# EAGLE design 2lboard (EAGLE 7.2.0)
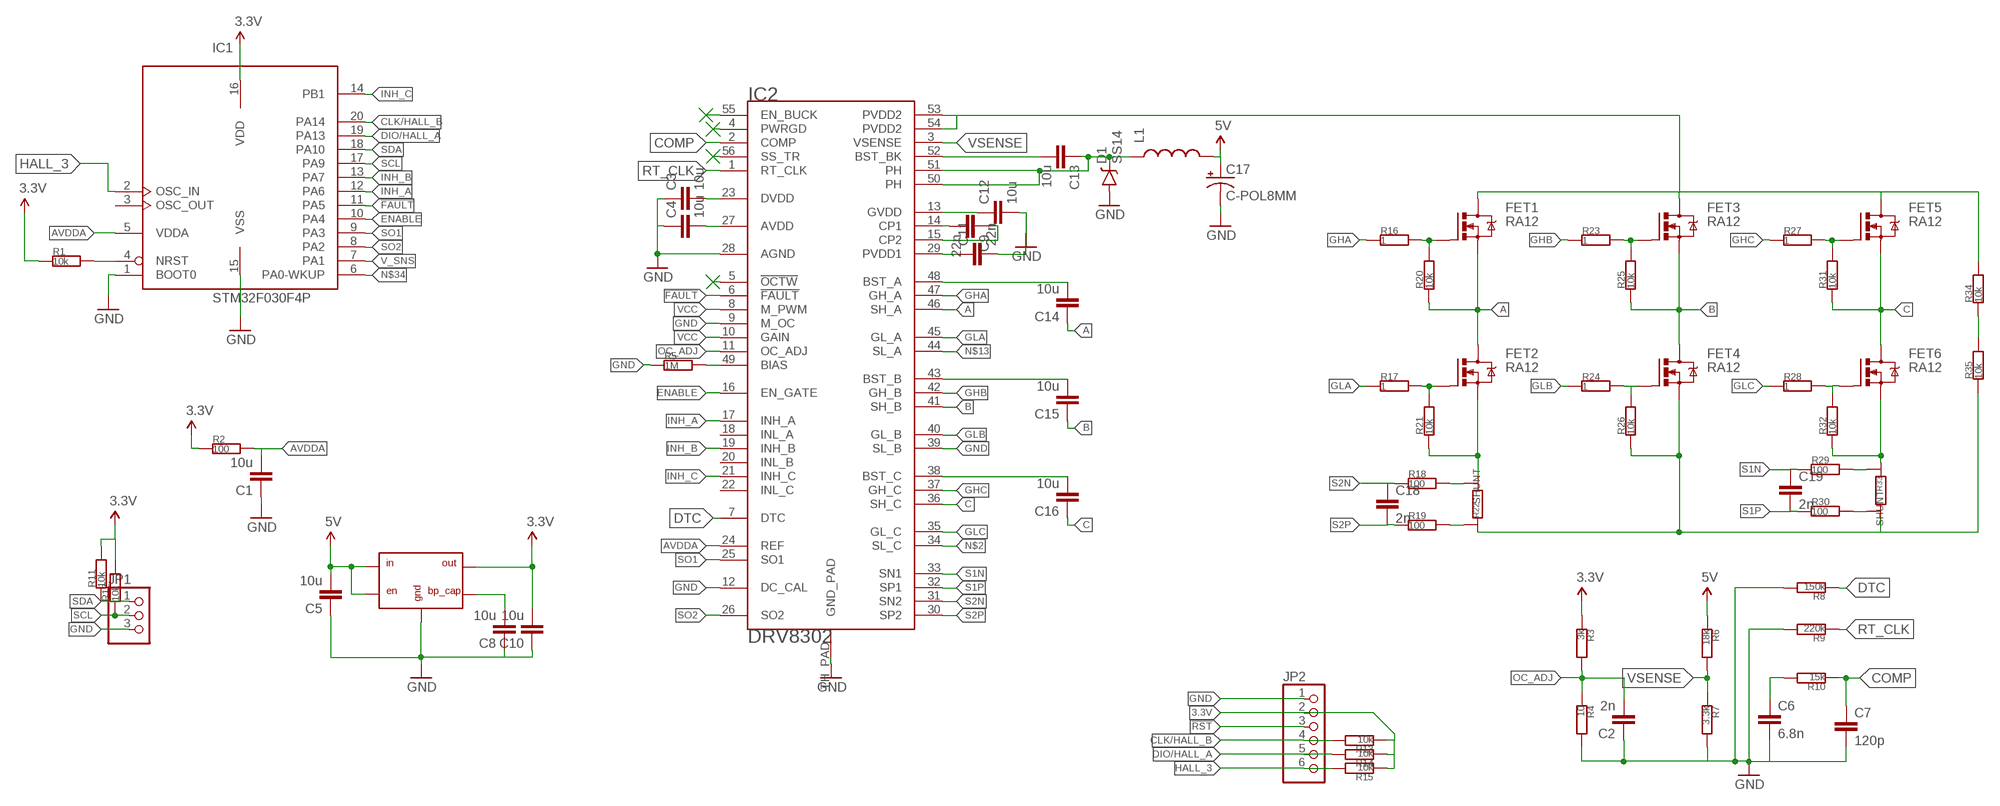
[diagram p0: schematic, sheet 1]

## Parts
C1  10u  CC0805  [C0805]
C2  2n  CC0805  [C0805]
C3  10u  CC0805  [C0805]
C4  10u  CC0805  [C0805]
C5  10u  CC0805  [C0805]
C6  6.8n  CC0805  [C0805]
C7  120p  CC0805  [C0805]
C8  10u  CC0805  [C0805]
C9  22n  CC0805  [C0805]
C10  10u  CC0805  [C0805]
C11  22n  CC0805  [C0805]
C12  10u  CC0805  [C0805]
C13  10u  CC0805  [C0805]
C14  10u  CC0805  [C0805]
C15  10u  CC0805  [C0805]
C16  10u  CC0805  [C0805]
C17  C-POL8MM  [PCAP8]
C18  2n  CC0805  [C0805]
C19  2n  CC0805  [C0805]
D1  SS14  [SMA-DIODE]
FET1  RA12  [POWERPAK_SO8]
FET2  RA12  [POWERPAK_SO8]
FET3  RA12  [POWERPAK_SO8]
FET4  RA12  [POWERPAK_SO8]
FET5  RA12  [POWERPAK_SO8]
FET6  RA12  [POWERPAK_SO8]
IC1  STM32F030F4P  [TSSOP20-I]
IC2  DRV8302  [HTSSOP56DCA]
IC3  LM258DG  [SOT23-5L]
JP1  PINHD-1X03_2.54  [1X03]
JP2  PINHD-1X06_2.54  [1X06]
L1  INDUCTORSRU1038  [SRU1038]
R1  10k  R0603  [0603]
R2  100  R0603  [0603]
R3  3k  R0603  [0603]
R4  10  R0603  [0603]
R5  1M  R0603  [0603]
R6  18k  R0603  [0603]
R7  3.3k  R0603  [0603]
R8  150k  R0603  [0603]
R9  220k  R0603  [0603]
R10  15k  R0603  [0603]
R11  10k  R0603  [0603]
R12  10k  R0603  [0603]
R13  10k  R0603  [0603]
R14  10k  R0603  [0603]
R15  10k  R0603  [0603]
R16  1  R0603  [0603]
R17  1  R0603  [0603]
R18  100  R0603  [0603]
R19  100  R0603  [0603]
R20  10k  R0603  [0603]
R21  10k  R0603  [0603]
R22  SHUNT  [SHUNT]
R23  1  R0603  [0603]
R24  1  R0603  [0603]
R25  10k  R0603  [0603]
R26  10k  R0603  [0603]
R27  1  R0603  [0603]
R28  1  R0603  [0603]
R29  100  R0603  [0603]
R30  100  R0603  [0603]
R31  10k  R0603  [0603]
R32  10k  R0603  [0603]
R33  SHUNT  [SHUNT]
R34  10k  R0603  [0603]
R35  10k  R0603  [0603]

## Nets
3.3V: C10.2 IC1.16(VDD) IC3.5(OUT) JP2.2 R1.1 R2.1 R3.1 R11.2 R12.2 R13.1 R14.1 R15.1
5V: C5.2 C17.P$1(+) IC3.1(IN) IC3.3(EN) L1.2 R6.1
!FAULT: IC1.11(PA5) IC2.6(!FAULT)
!RST: IC1.4(NRST) JP2.3 R1.2
A: C14.1 FET1.1(S) FET1.2(S) FET1.3(S) FET2.5(D) FET2.6(D) FET2.7(D) FET2.8(D) FET2.P$1(D) IC2.46(SH_A) R20.1
AVDDA: C1.2 IC1.5(VDDA) IC2.24(REF) R2.2
B: C15.1 FET3.1(S) FET3.2(S) FET3.3(S) FET4.5(D) FET4.6(D) FET4.7(D) FET4.8(D) FET4.P$1(D) IC2.41(SH_B) R25.1
C: C16.1 FET5.1(S) FET5.2(S) FET5.3(S) FET6.5(D) FET6.6(D) FET6.7(D) FET6.8(D) FET6.P$1(D) IC2.36(SH_C) R31.1
CLK/HALL_B: IC1.20(PA14) JP2.4 R13.2
COMP: C7.1 IC2.2(COMP) R10.1
DIO/HALL_A: IC1.19(PA13) JP2.5 R14.2
DTC: IC2.7(DTC) R8.1
ENABLE: IC1.10(PA4) IC2.16(EN_GATE)
GHA: IC2.47(GH_A) R16.1
GHB: IC2.42(GH_B) R23.1
GHC: IC2.37(GH_C) R27.1
GLA: IC2.45(GL_A) R17.1
GLB: IC2.40(GL_B) R24.1
GLC: IC2.35(GL_C) R28.1
GND: C1.1 C2.1 C3.1 C4.1 C5.1 C6.2 C7.2 C8.1 C10.1 C11.2 C12.2 C17.P$2(-) D1.A FET4.1(S) FET4.2(S) FET4.3(S) IC1.1(BOOT0) IC1.15(VSS) IC2.9(M_OC) IC2.12(DC_CAL) IC2.28(AGND) IC2.39(SL_B) IC2.TH_PAD(GND_PAD) IC3.2(GND) JP1.3 JP2.1 R4.2 R5.1 R7.2 R8.2 R9.2 R22.P$1 R26.1 R33.P$2 R35.1
HALL_3: IC1.2(OSC_IN) JP2.6 R15.2
INH_A: IC1.12(PA6) IC2.17(INH_A)
INH_B: IC1.13(PA7) IC2.19(INH_B)
INH_C: IC1.14(PB1) IC2.21(INH_C)
N$2: FET6.1(S) FET6.2(S) FET6.3(S) IC2.34(SL_C) R32.1 R33.P$1
N$3: C14.2 IC2.48(BST_A)
N$4: C15.2 IC2.43(BST_B)
N$5: FET5.4(G) R27.2 R31.2
N$6: FET3.4(G) R23.2 R25.2
N$7: FET1.4(G) R16.2 R20.2
N$8: FET2.4(G) R17.2 R21.2
N$9: FET4.4(G) R24.2 R26.2
N$10: C16.2 IC2.38(BST_C)
N$11: FET6.4(G) R28.2 R32.2
N$12: IC2.49(BIAS) R5.2
N$13: FET2.1(S) FET2.2(S) FET2.3(S) IC2.44(SL_A) R21.1 R22.P$2
N$14: C9.1 IC2.15(CP2)
N$15: C9.2 IC2.14(CP1)
N$16: C12.1 IC2.13(GVDD)
N$17: IC2.55(EN_BUCK)
N$18: C13.2 IC2.52(BST_BK)
N$19: C13.1 D1.C IC2.50(PH) IC2.51(PH) L1.1
N$21: C6.1 R10.2
N$22: IC2.4(PWRGD)
N$23: IC2.56(SS_TR)
N$24: C8.2 IC3.4(CAP)
N$26: IC2.5(!OCTW)
N$27: C3.2 IC2.23(DVDD)
N$28: C4.2 IC2.27(AVDD)
N$29: C11.1 IC2.29(PVDD1)
N$34: IC1.6(PA0-WKUP)
OC_ADJ: C2.2 IC2.11(OC_ADJ) R3.2 R4.1
RT_CLK: IC2.1(RT_CLK) R9.1
S1N: C19.1 IC2.33(SN1) R29.1
S1P: C19.2 IC2.32(SP1) R30.1
S2N: C18.1 IC2.31(SN2) R18.1
S2P: C18.2 IC2.30(SP2) R19.1
SCL: IC1.17(PA9) JP1.2 R12.1
SDA: IC1.18(PA10) JP1.1 R11.1
SO1: IC1.9(PA3) IC2.25(SO1)
SO2: IC1.8(PA2) IC2.26(SO2)
SS1N: R18.2 R22.P$4
SS1P: R19.2 R22.P$3
SS2N: R29.2 R33.P$3
SS2P: R30.2 R33.P$4
V_SNS: IC1.7(PA1) R34.1 R35.2
VCC: FET1.5(D) FET1.6(D) FET1.7(D) FET1.8(D) FET1.P$1(D) FET3.5(D) FET3.6(D) FET3.7(D) FET3.8(D) FET3.P$1(D) FET5.5(D) FET5.6(D) FET5.7(D) FET5.8(D) FET5.P$1(D) IC2.8(M_PWM) IC2.10(GAIN) IC2.53(PVDD2) IC2.54(PVDD2) R34.2
VSENSE: IC2.3(VSENSE) R6.2 R7.1
Unconnected: IC1.3(OSC_OUT) IC2.18(INL_A) IC2.20(INL_B) IC2.22(INL_C)

## Library data of the parts
C1-C16 C18 C19 = CasaLibrary:C: Capacitor
C17 = CasaLibrary:C-POL
D1 = CasaLibrary:SS14
FET1-FET6 = CasaLibrary:RA12
IC1 = micro-stm_v3:STM32F030F*P: ARM 32-bit Cortex™-M0 CPU 48 MHz maximum frequency 16 Kbytes of Flash memory 4 kbytes of SRAM 15 GPIOs 2.4 to 3.6 V application supply
IC2 = DRV8301:DRV8302
IC3 = CasaLibrary:LM258DG
JP1 = pinhead-2:PINHD-1X03: PIN HEADER
JP2 = pinhead-2:PINHD-1X06: PIN HEADER
L1 = SparkFun-Passives:INDUCTOR: Inductors Basic Inductor/Choke - 0603 and 1206. Footprints are not proven and vary greatly between part numbers. INDUCTOR POWER 3.3UH 4.0A SMD 0.197" L x 0.197" W x 0.177" H (5.00mm x 5.00mm x 4.50mm)
R1-R21 R23-R32 R34 R35 = CasaLibrary:R
R22 R33 = CasaLibrary:SHUNT

## Board
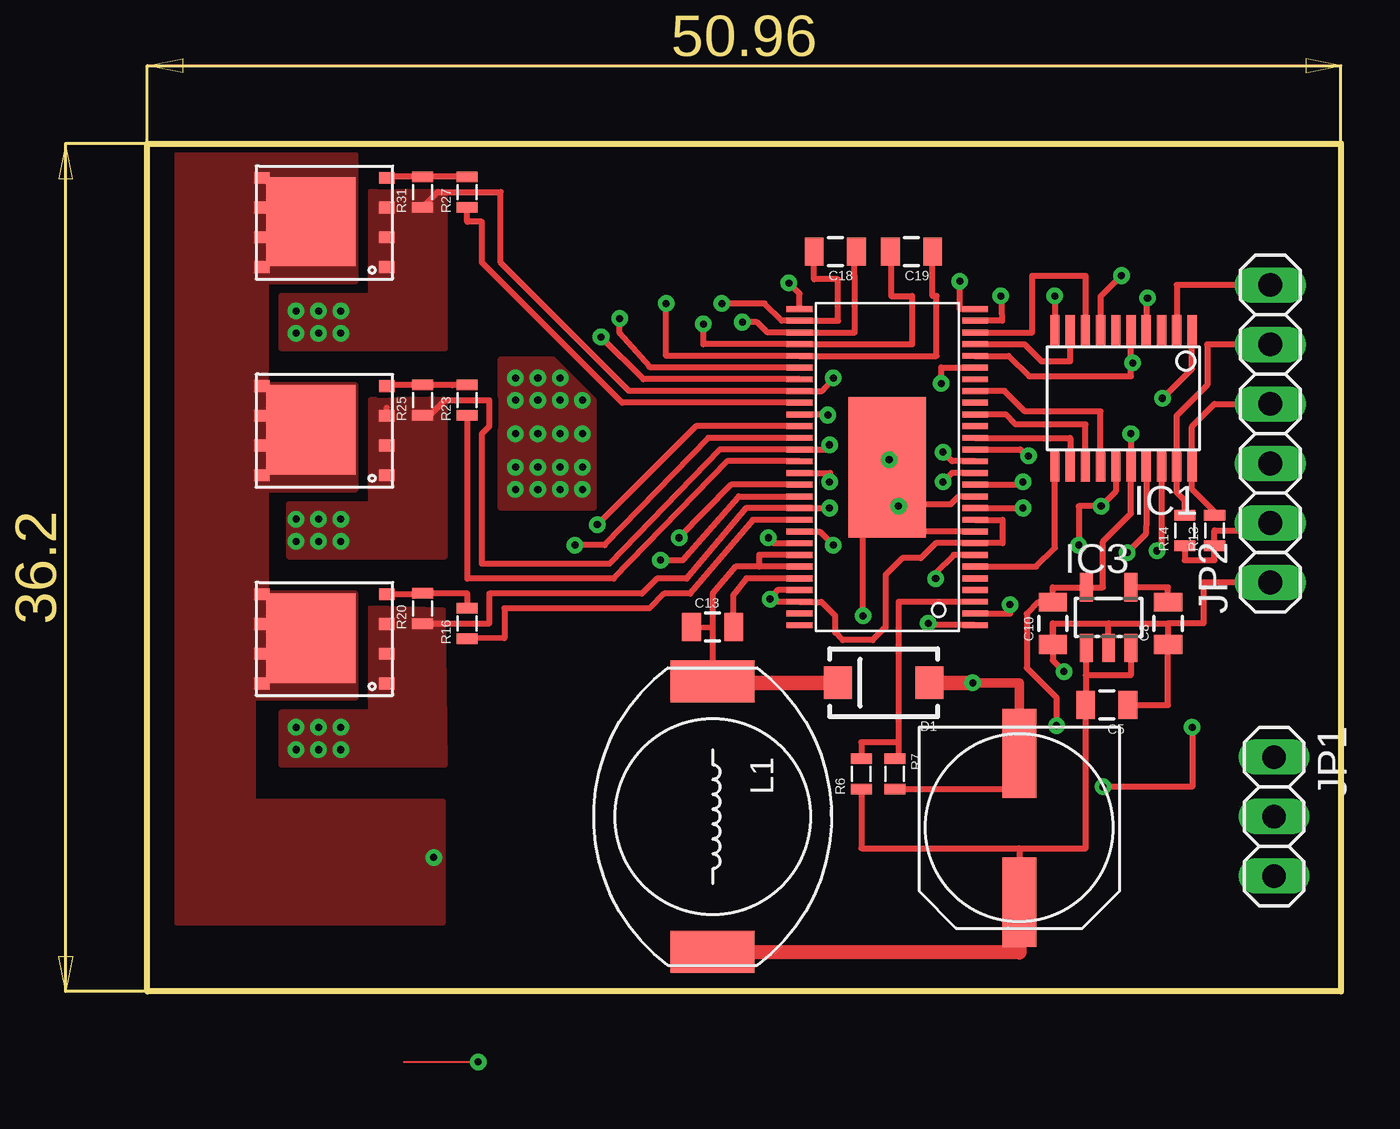
[diagram p1: board, top side]
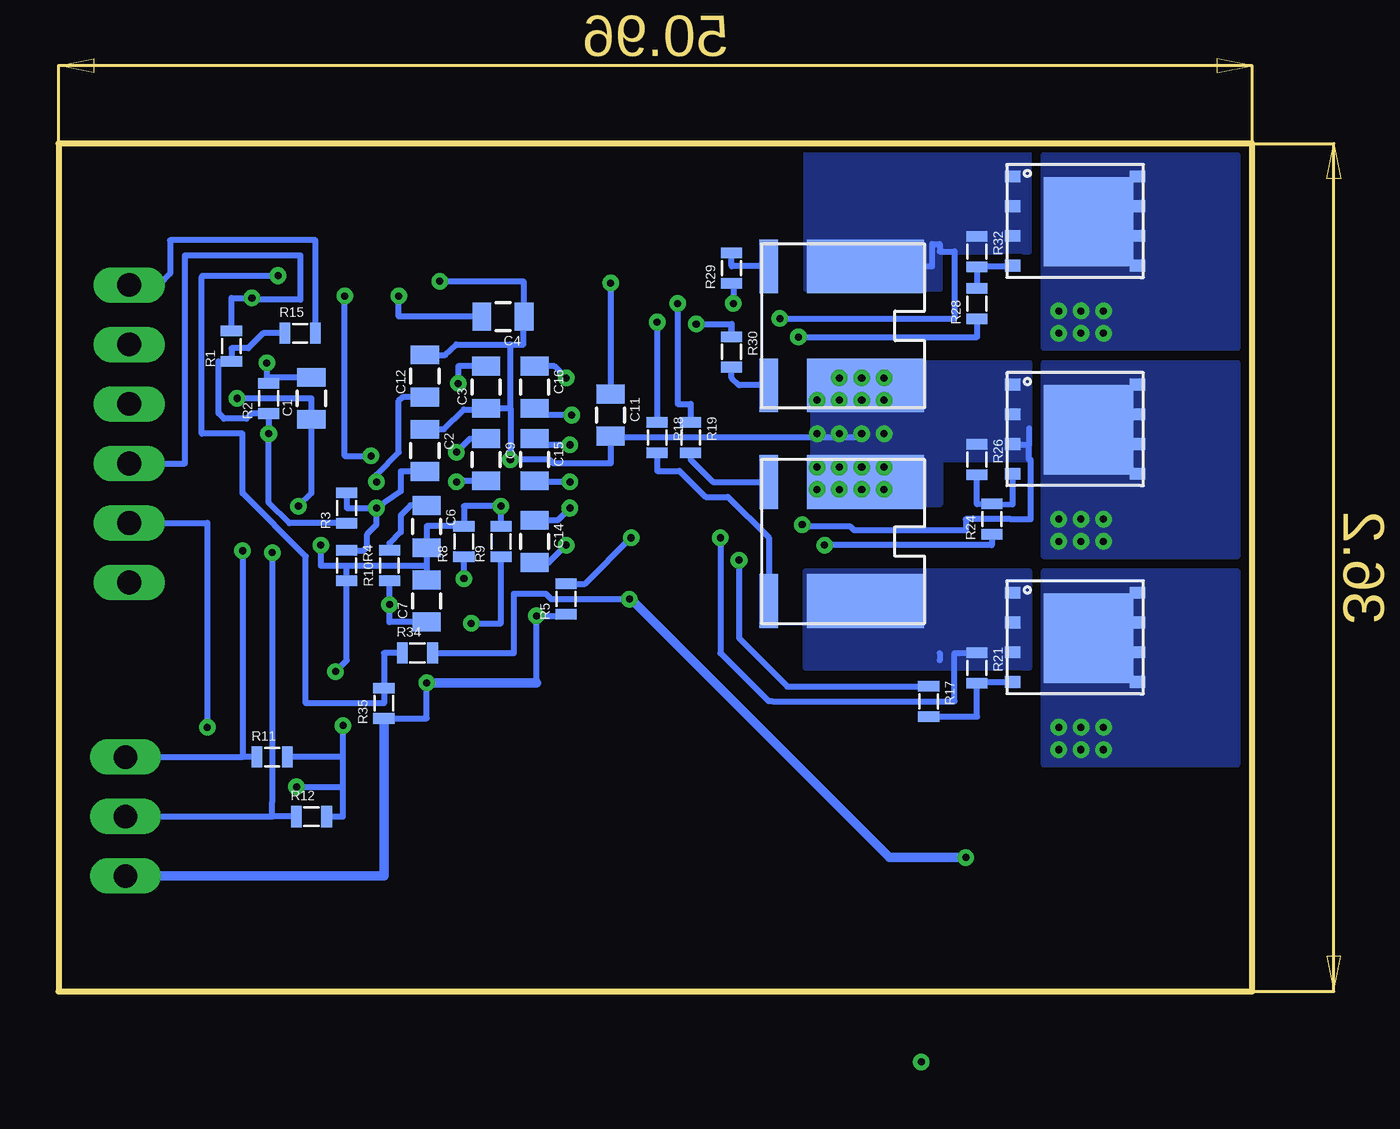
[diagram p2: board, bottom side, seen from below]

Size 50.96 x 36.2 mm. Coordinates in mm from the lower left corner, seen from the top.
Outline: 0,36.2 50.96,36.2 50.96,0 0,0 0,36.2
Copper layers (1*16): Top 0.035mm / dielectric 1.5mm / Bottom 0.035mm
Design rules "new *": minimum track width 0.25mm, minimum drill 0.3mm, track to track 0.25mm, track to pad 0.25mm, pad to pad 0.25mm, via to via 0.25mm, smd to smd 0.25mm, copper to edge 0.25mm, drill to drill 0.25mm, minimum pad ring 10mil, minimum via ring 8mil, stop-mask expansion 0mil, vias tented up to drill 0mil, thermal gap 10mil

### Footprints (pad centres in the part's own frame; a part is rotated, then mirrored left to right if it is on the bottom)
C0805 = smd 0.8 x 1.2: 1 -0.9,0; 2 0.9,0
PCAP8 = smd 3.8 x 1.46: P$1 -3.175,0; P$2 3.175,0
SMA-DIODE = smd 1.2 x 1.4: A -1.95,0; C 1.95,0
POWERPAK_SO8 = smd 0.66 x 0.5: 1 -2.603,1.937; 2 -2.603,0.667; 3 -2.603,-0.603; 4 -2.603,-1.873; 5 2.731,-1.873; 6 2.731,-0.603; 7 2.731,0.667; 8 2.731,1.937 | smd 3.81 x 3.81: P$1 0.635,0
TSSOP20-I = smd 0.4 x 1.35: 1 -2.925,-2.875; 2 -2.275,-2.875; 3 -1.625,-2.875; 4 -0.975,-2.875; 5 -0.325,-2.875; 6 0.325,-2.875; 7 0.975,-2.875; 8 1.625,-2.875; 9 2.275,-2.875; 10 2.925,-2.875; 11 2.925,2.875; 12 2.275,2.875; 13 1.625,2.875; 14 0.975,2.875; 15 0.325,2.875; 16 -0.325,2.875; 17 -0.975,2.875; 18 -1.625,2.875; 19 -2.275,2.875; 20 -2.925,2.875
HTSSOP56DCA = smd 0.25 x 1.1: 1 -6.75,-3.75; 2 -6.25,-3.75; 3 -5.75,-3.75; 4 -5.25,-3.75; 5 -4.75,-3.75; 6 -4.25,-3.75; 7 -3.75,-3.75; 8 -3.25,-3.75; 9 -2.75,-3.75; 10 -2.25,-3.75; 11 -1.75,-3.75; 12 -1.25,-3.75; 13 -0.75,-3.75; 14 -0.25,-3.75; 15 0.25,-3.75; 16 0.75,-3.75; 17 1.25,-3.75; 18 1.75,-3.75; 19 2.25,-3.75; 20 2.75,-3.75; 21 3.25,-3.75; 22 3.75,-3.75; 23 4.25,-3.75; 24 4.75,-3.75; 25 5.25,-3.75; 26 5.75,-3.75; 27 6.25,-3.75; 28 6.75,-3.75; 29 6.75,3.75; 30 6.25,3.75; 31 5.75,3.75; 32 5.25,3.75; 33 4.75,3.75; 34 4.25,3.75; 35 3.75,3.75; 36 3.25,3.75; 37 2.75,3.75; 38 2.25,3.75; 39 1.75,3.75; 40 1.25,3.75; 41 0.75,3.75; 42 0.25,3.75; 43 -0.25,3.75; 44 -0.75,3.75; 45 -1.25,3.75; 46 -1.75,3.75; 47 -2.25,3.75; 48 -2.75,3.75; 49 -3.25,3.75; 50 -3.75,3.75; 51 -4.25,3.75; 52 -4.75,3.75; 53 -5.25,3.75; 54 -5.75,3.75; 55 -6.25,3.75; 56 -6.75,3.75 | smd 6 x 3.3: TH_PAD 0,0
SOT23-5L = smd 0.55 x 1.2: 1 -0.95,-1.3; 2 0,-1.3; 3 0.95,-1.3; 4 0.95,1.3; 5 -0.95,1.3
1X03 = drill 1.016 long: 1 -2.54,0; 2 0,0; 3 2.54,0
1X06 = drill 1.016 long: 1 -6.35,0; 2 -3.81,0; 3 -1.27,0; 4 1.27,0; 5 3.81,0; 6 6.35,0
SRU1038 = smd 1.8 x 3.6: 1 -5.77,0; 2 5.77,0
0603 = smd 0.45 x 0.9: 1 -0.65,0; 2 0.65,0
SHUNT = smd 2.3 x 5: P$1 6.032,2.54; P$2 0.953,2.54 | smd 2.3 x 0.8: P$3 6.032,6.668; P$4 0.953,6.668

### Placement (x,y rotation side)
C1  40.16,25.32 90 bottom
C2  35.32,23.1 270 bottom
C3  32.7,25.8 90 bottom
C4  31.99,28.81 180 bottom
C5  40.96,12.22 180 top
C6  35.24,19.84 270 bottom
C7  35.24,16.67 90 bottom
C8  43.58,15.72 90 top
C9  32.7,22.7 270 bottom
C10  38.66,15.72 90 top
C11  27.38,24.61 270 bottom
C12  35.32,26.27 90 bottom
C13  24.13,15.56 0 top
C14  30.64,19.21 270 bottom
C15  30.64,22.7 270 bottom
C16  30.64,25.8 270 bottom
C17  37.23,6.99 90 top
C18  29.37,31.59 180 top
C19  32.62,31.59 180 top
D1  31.43,13.18 180 top
FET1  7.62,15.08 180 top
FET2  7.62,15.08 0 bottom
FET3  7.62,23.97 180 top
FET4  7.62,23.97 0 bottom
FET5  7.62,32.86 180 top
FET6  7.62,32.86 0 bottom
IC1  41.67,25.32 180 top
IC2  31.59,22.38 90 top
IC3  41.04,15.95 0 top
JP1  48.1,7.46 270 top
JP2  47.94,23.81 90 top
L1  24.13,7.46 270 top
R1  43.58,27.54 90 bottom
R2  41.99,25.32 90 bottom
R3  38.66,20.64 90 bottom
R4  38.66,18.18 270 bottom
R5  29.29,16.75 90 bottom
R6  30.48,9.29 90 top
R7  31.91,9.29 270 top
R8  33.66,19.21 90 bottom
R9  32.07,19.21 90 bottom
R10  36.83,18.18 90 bottom
R11  41.83,10 0 bottom
R12  40.16,7.46 0 bottom
R13  45.56,19.69 90 top
R14  44.29,19.69 90 top
R15  40.64,28.1 0 bottom
R16  13.65,15.72 90 top
R17  13.81,12.38 270 bottom
R18  25.4,23.65 270 bottom
R19  23.97,23.65 270 bottom
R20  11.75,16.35 90 top
R21  11.75,13.81 270 bottom
R22  13.97,15.72 90 bottom
R23  13.65,25.24 90 top
R24  11.11,20.16 90 bottom
R25  11.75,25.24 90 top
R26  11.75,22.7 270 bottom
R27  13.65,34.13 90 top
R28  11.75,29.37 90 bottom
R29  22.23,30.88 90 bottom
R30  22.23,27.31 270 bottom
R31  11.75,34.13 90 top
R32  11.75,31.59 270 bottom
R33  13.97,24.92 90 bottom
R34  35.64,14.45 0 bottom
R35  37.07,12.3 90 bottom

### Tracks (layer width: path | path; a pad name or v marks a point on that pad's centre or on a via)
3.3V  (via drill 0.3, 0.3 pad 0.61)
  Top 0.25: v41.99,23.81 42,23.58 IC1.16 | v44.61,11.27 44.61,8.73 v40.8,8.73 | R14.1 44.29,18.41 45.56,18.41 R13.1 45.56,19.68 47.94,19.68 JP2.2
  Top 0.254: IC1.16 42,20.41 40.8,19.21 40.8,17.25 IC3.5 38.66,17.25 C10.2 38.05,16.62 37.54,16.11 37.54,13.81 38.81,12.54 v38.81,11.35
  Bottom 0.25: R2.1 v41.99,23.81 41.99,20.88 41.1,19.99 R3.1 | JP2.2 44.61,20 v44.61,11.27 | v40.8,8.73 38.81,8.73 | R15.1 42.23,28.1 42.86,27.46 43.58,27.46 R1.1
  Bottom 0.254: R12.2 38.81,7.46 38.81,8.73 38.81,10 | 38.81,10 R11.2 | 38.81,10 v38.81,11.35 | R2.1 42.72,24.67 42.94,24.45 43.89,24.45 44.13,24.69 44.13,26.89 R1.1
5V
  Top 0.25: R6.1 30.48,6.11 37.23,6.11 | 37.23,6.11 C17.P$1 | 37.23,6.11 40.06,6.11 C5.2 40.06,13.49 40.08,13.49
  Top 0.254: IC3.3 41.99,13.49 40.08,13.49 40.08,14.73 IC3.1
  Top 0.61: L1.2 37.23,1.67 C17.P$1
!FAULT
  Top 0.25: IC2.6 37.94,18.13 38.75,18.94 IC1.11
!RST  (via drill 0.3)
  Top 0.254: v42.7,29.61 42.65,29.61 IC1.4
  Bottom 0.25: v42.7,29.61 42.7,29.53 40.64,29.53 40.64,31.43 45.56,31.43 45.56,22.54 JP2.3
  Bottom 0.254: R1.2 43.58,29.61 v42.7,29.61
A  (via drill 0.3)
  Top 0.25: v29.13,20.64 28.74,20.63 IC2.46 25.55,20.63 23.02,17.62 21.75,17.62 21.11,16.99 14.61,16.99 14.61,15.72 12.14,15.72 11.76,15.8 R20.1
  Bottom 0.25: v29.13,20.64 29.66,20.11 C14.1
  other vias: 8.26,11.27 7.3,11.27 6.35,11.27 6.35,10.32 7.3,10.32 8.26,10.32
  pour Bottom (no thermals): 8.89,17.94 0.64,17.94 0.64,9.68 8.89,9.68
  pour Top (no thermals): 12.62,16.27 9.53,16.35 9.53,11.91 5.71,11.91 5.71,9.68 12.7,9.68
AVDDA  (via drill 0.3)
  Top 0.25: 42,26.83 IC1.5 | IC2.24 36.76,27.13 37.64,26.26 42,26.26 42,26.83 | 42,26.83 v42.07,26.83
  Bottom 0.25: R2.2 42.04,26.11 42.07,26.22 | 42.07,26.22 C1.2 | v42.07,26.83 42.07,26.22
B  (via drill 0.3)
  Top 0.25: FET3.3 10.22,24.92 | R25.1 12.05,24.59 12.7,25.24 14.61,25.24 14.61,24.13 14.29,23.81 14.29,18.26 19.73,18.26 24.45,23.13 IC2.41 29.17,23.13 v29.13,23.34
  Bottom 0.25: v29.13,23.34 30.64,23.34 C15.1
  other vias: 8.26,20.16 7.3,20.16 6.35,20.16 6.35,19.21 7.3,19.21 8.26,19.21
  pour Bottom (no thermals): 8.89,26.83 0.64,26.83 0.64,18.57 8.89,18.57
  pour Top (no thermals): 12.7,25.24 9.53,25.24 9.53,20.8 6.03,20.8 6.03,18.57 12.7,18.57
C  (via drill 0.3)
  Top 0.25: v29.29,26.19 28.81,25.63 IC2.36 20.56,25.63 15.08,31.11 15.08,34.13 12.4,34.13 R31.1
  Bottom 0.25: v29.29,26.19 29.79,26.7 C16.1
  other vias: 8.26,29.05 7.3,29.05 6.35,29.05 6.35,28.1 7.3,28.1 8.26,28.1
  pour Top (no thermals): 12.7,34.13 9.53,34.13 9.53,29.69 5.71,29.69 5.71,27.46 12.7,27.46
  pour Bottom (no thermals): 8.89,35.72 0.64,35.72 0.64,27.46 8.89,27.46
CLK/HALL_B
  Top 0.25: JP2.4 45.56,25.08 44.6,24.12 IC1.20 44.6,21.44 45.56,20.48 R13.2
COMP  (via drill 0.3)
  Top 0.25: IC2.2 36.83,16.13 v36.83,16.51
  Bottom 0.25: R10.1 v36.83,16.51 36.83,15.77 C7.1 35.34,15.77
DIO/HALL_A
  Top 0.25: JP2.5 45.24,27.62 45.24,25.88 43.95,24.58 IC1.19 43.95,21.3 44.29,20.95 R14.2
DTC  (via drill 0.3)
  Top 0.25: IC2.7 34.43,18.63 33.66,17.86 v33.66,17.62
  Bottom 0.25: v33.66,17.62 R8.1
ENABLE  (via drill 0.3)
  Top 0.25: IC2.16 37.27,23.13 v37.62,22.86 | v38.73,29.69 38.75,29.67 IC1.10
  Bottom 0.25: v38.73,29.69 38.73,22.86 v37.62,22.86
GHA
  Top 0.25: IC2.47 25.85,20.13 23.18,16.99 22.07,16.99 21.43,16.35 15.24,16.35 15.24,15.08 R16.1
GHB
  Top 0.25: IC2.42 24.77,22.63 19.91,17.62 13.65,17.62 R23.1
GHC
  Top 0.25: IC2.37 20.27,25.13 14.29,31.11 14.29,32.86 13.65,32.86 R27.1 13.65,33.5
GLA  (via drill 0.3)
  Top 0.25: v21.91,18.41 22.86,18.41 25.24,21.11 25.24,21.13 IC2.45
  Bottom 0.25: v21.91,18.41 21.91,15.08 19.84,13.02 R17.1
GLB  (via drill 0.3)
  Top 0.25: IC2.40 23.95,23.63 19.53,19.05
  Top 0.254: 19.53,19.05 v18.26,19.05
  Bottom 0.25: R24.1 11.11,19.05 v18.26,19.05
GLC  (via drill 0.3)
  Top 0.25: IC2.35 21.17,26.13 v19.37,27.94
  Bottom 0.25: R28.1 11.75,27.94 v19.37,27.94
GND  (via drill 0.3, 0.3 pad 0.61)
  Top 0.25: IC2.39 23.42,24.13 v19.21,19.92 | v30.56,16.03 30.56,20.72 31.59,20.72 | IC2.28 34.69,29.13 34.69,29.69 v34.69,30.32 | 31.59,20.72 IC2.TH_PAD 31.59,22.7 v31.67,22.7 | IC1.15 41.35,21.34 v40.72,20.72 39.77,20.72 v39.77,19.05 | R7.2 37.23,8.64 C17.P$2 | C5.1 43.58,12.22 C8.1 | 38.66,15.72 38.66,14.13 v39.13,13.65 | v43.34,25.32 44.6,26.58 IC1.1 | v32.07,20.72 31.59,20.72 | IC2.12 34.63,21.13 34.29,20.8 32.15,20.8 v32.07,20.72 | IC2.9 32.29,19.63 R9.2 v32.07,20.72 | JP2.1 45.09,17.46 45.09,15.72 43.58,15.72
  Top 0.254: IC3.2 41.04,15.72 | 41.04,15.72 43.58,15.72 C8.1 | C10.1 38.66,15.72 41.04,15.72
  Top 0.406: v35.24,13.18 37.23,13.18 C17.P$2
  Top 0.61: v35.24,13.18 D1.A
  Bottom 0.25: 10.32,20.16 12.22,20.16 12.22,19.68 16.99,19.68 17.14,19.84 19.21,19.84 v19.21,19.92 | 35.24,18.1 C6.2 35.24,19.86 R8.2 33.66,20.72 v32.07,20.72 R9.2 | 35.24,18.1 C7.2 | 30.56,13.18 v30.56,16.03 29.35,16.03 R5.1 | v34.69,30.32 31.11,30.32 31.11,28.68 | 31.11,28.68 C4.1 | 31.67,24.9 C3.1 32.76,24.84 33.66,24.84 34.5,24 C2.1 | 31.67,24.9 31.67,27.62 | 31.67,27.62 31.11,27.62 31.11,28.68 | 31.67,24.9 v31.67,22.7 | 9.53,24.05 9.53,23.34 10.16,23.34 | C12.2 34.45,27.17 33.97,27.62 31.67,27.62 | 31.67,22.54 v31.67,22.7 | v31.67,22.7 30,22.7 29.84,22.54 27.38,22.54 C11.2 27.38,23.65 16.83,23.65 16.83,23.81 | v40.72,20.72 40.16,21.27 C1.1 40.16,25.32 v43.34,25.32 | 38.66,18.18 R4.2 38.66,14.13 v39.13,13.65 | 38.66,18.18 35.32,18.18 arc90 35.24,18.1 | v39.77,19.05 39.77,18.18 38.66,18.18 | R35.1 35.24,11.65 v35.24,13.18
  Bottom 0.254: 10.32,20.16 9.45,20.16 9.45,22.7 9.53,22.7 9.53,23.34
  Bottom 0.406: v35.24,13.18 30.56,13.18 | JP1.3 37.07,4.92 R35.1
  other vias: 15.72,23.81 16.67,23.81 17.62,23.81 18.57,23.81 15.72,22.38 16.67,22.38 17.62,22.38 18.57,22.38 18.57,21.43 17.62,21.43 16.67,21.43 15.72,21.43 15.72,25.24 15.72,26.19 16.67,26.19 16.67,25.24 17.62,25.24 17.62,26.19 18.57,25.24
  pour Bottom (no thermals): 18.73,26.83 9.53,26.83 9.53,22.7 13.34,22.7 13.34,20.8 18.73,20.8
  pour Top: 15.08,20.64 15.08,26.99 17.3,26.99 19.05,25.24 19.05,20.64
HALL_3
  Top 0.25: JP2.6 43.95,30.16 IC1.2
  Bottom 0.25: R15.2 39.99,32.07 46.2,32.07 46.2,30.64 46.67,30.16 JP2.6
INH_A
  Top 0.25: IC2.17 39.4,23.63 IC1.12
INH_B
  Top 0.25: IC1.13 40.05,24.21 37.07,24.21 36.64,24.63 IC2.19
INH_C
  Top 0.25: IC1.14 40.7,24.77 37.47,24.77 36.6,25.63 IC2.21
N$1  (via drill 0.3 pad 0.61)
  Top 0.075: 10.95,-3.02 v14.13,-3.02
N$2  (via drill 0.3)
  Top 0.25: IC2.34 21.47,26.63 21.43,26.67 20.16,28.1 v20.16,28.73
  Bottom 0.25: R33.P$1 13.65,30.96 13.65,31.91 13.34,31.91 13.34,31.59 12.7,31.59 12.7,28.73 v20.16,28.73
  pour Bottom (no thermals): 19.05,30 13.34,30 13.34,31.59 9.53,31.59 9.53,35.72 19.05,35.72
N$3  (via drill 0.3)
  Top 0.25: IC2.48 28.71,19.63 v29.29,19.05
  Bottom 0.25: v29.29,19.05 30.03,18.31 C14.2
N$4  (via drill 0.3)
  Top 0.25: IC2.43 29.14,22.13 v29.13,21.75
  Bottom 0.25: v29.13,21.75 30.59,21.75 C15.2
N$5
  Top 0.25: FET5.4 10.22,34.78 R31.2 R27.2
N$6
  Top 0.25: R23.2 13.02,25.88 R25.2 10.22,25.89 FET3.4
N$7
  Top 0.25: FET1.4 11.75,16.95 R20.2 13.64,17 13.65,16.99 R16.2
N$8
  Bottom 0.25: FET2.4 11.75,13.21 R21.2 11.75,11.73 R17.2
N$9
  Bottom 0.25: 10.27,22.05 FET4.4 10.22,20.8 R24.2 11.75,20.8 R26.2
N$10  (via drill 0.3)
  Top 0.25: v29.05,24.61 29.02,24.63 IC2.38
  Bottom 0.25: v29.05,24.61 30.64,24.61 C16.2
N$11
  Bottom 0.25: FET6.4 10.22,30.94 R32.2 R28.2
N$12  (via drill 0.3)
  Top 0.25: v26.51,19.37 26.75,19.13 IC2.49
  Bottom 0.25: R5.2 28.48,17.4 v26.51,19.37
N$13  (via drill 0.3)
  Top 0.25: IC2.44 24.92,21.63 v22.7,19.37
  Bottom 0.25: v22.7,19.37 22.7,14.45 20.64,12.38 20.48,12.38 | 13.34,14.45 13.34,14.13 | 12.86,12.38 12.7,12.38 12.7,14.45 11.75,14.45 R21.1
  Bottom 0.254: 20.48,12.38 12.86,12.38
  pour Bottom (no thermals): 19.05,17.94 9.53,17.94 9.53,13.81 19.05,13.81
N$14  (via drill 0.3)
  Top 0.25: IC2.15 34.36,22.63 v33.97,23.02
  Bottom 0.25: v33.97,23.02 33.39,23.6 C9.1
N$15  (via drill 0.3)
  Top 0.25: IC2.14 34.36,22.13 v33.97,21.75
  Bottom 0.25: v33.97,21.75 33.95,21.8 C9.2
N$16  (via drill 0.3)
  Top 0.25: IC2.13 37.27,21.63 v37.39,21.75
  Bottom 0.25: C12.1 36.27,25.37 36.43,25.21 36.43,23.02 37.39,22.07 v37.39,21.75
N$18
  Top 0.25: IC2.52 25.57,17.63 25,16.91 25,15.59 C13.2
N$19
  Top 0.25: C13.1 24.13,15.53 | 24.13,15.53 L1.1 | IC2.51 26.11,18.13 | 26.11,18.13 25.12,18.13 24.13,16.99 24.13,15.53 | IC2.50 26.11,18.63 26.11,18.13
  Top 0.254: L1.1 24.18,13.23
  Top 0.61: D1.C 24.13,13.18 L1.1
N$21
  Bottom 0.25: R10.2 36.83,19.13 36.35,19.61 36.35,20.32 35.93,20.74 C6.1
N$24
  Top 0.254: C8.2 43.58,17.25 IC3.4
N$27  (via drill 0.3)
  Top 0.25: v33.89,25.96 33.89,26.63 IC2.23
  Bottom 0.25: C3.2 33.89,26.7 v33.89,25.96
N$28  (via drill 0.3)
  Top 0.25: v36.43,29.69 36.49,28.63 IC2.27
  Bottom 0.25: C4.2 36.43,28.81 v36.43,29.69
N$29  (via drill 0.3)
  Top 0.25: IC2.29 27.84,29.79 v27.38,30.24
  Bottom 0.25: v27.38,30.24 C11.1
OC_ADJ  (via drill 0.3)
  Top 0.25: IC2.11 v37.39,20.63 v37.39,20.64
  Bottom 0.25: 35.35,22.22 C2.2 36.35,22.2 36.35,21.35 v37.39,20.63 v37.39,20.64 | R3.2 38.66,20.64 v37.39,20.64 | R4.1 37.93,18.83 37.78,18.97 37.78,19.53 37.39,19.92 v37.39,20.64
RT_CLK  (via drill 0.3)
  Top 0.25: IC2.1 33.42,15.63 v33.34,15.72
  Bottom 0.25: v33.34,15.72 32.07,15.72 R9.1
S1N  (via drill 0.3)
  Top 0.25: C19.1 33.52,29.69 33.7,29.69 33.7,27.13 IC2.33 22.15,27.13 v22.15,29.37
  Bottom 0.25: R29.1 22.15,30.23 v22.15,29.37
S1P  (via drill 0.3)
  Top 0.25: C19.2 31.75,30.96 31.75,29.69 32.66,29.69 32.66,27.63 IC2.32 23.73,27.63 v23.73,28.5
  Bottom 0.25: 22.23,28.42 22.24,27.88 R30.1 22.23,28.5 v23.73,28.5
S2N  (via drill 0.3)
  Top 0.25: C18.1 30.19,31.51 30.2,29.69 30.2,28.13 IC2.31 26.48,28.13 26.04,28.57 v25.4,28.57
  Bottom 0.25: v25.4,28.57 R18.1
S2P  (via drill 0.3)
  Top 0.25: C18.2 28.47,30.4 29.49,30.4 29.49,28.63 IC2.30 27.09,28.63 26.35,29.37 v24.53,29.37
  Bottom 0.25: v24.53,29.37 24.53,25.08 23.97,25.08 R19.1
SCL  (via drill 0.3)
  Top 0.25: IC1.17 42.65,19.87
  Top 0.254: v41.83,18.73 42.65,19.55 42.65,19.87
  Bottom 0.25: v41.83,18.73 41.83,8.1
  Bottom 0.254: JP1.2 41.83,7.46 | 41.83,7.46 41.83,8.1 | R12.1 41.83,7.46
SDA  (via drill 0.3)
  Top 0.25: IC1.18 43.3,19.01 v43.1,18.81
  Bottom 0.25: v43.1,18.81 43.1,10
  Bottom 0.254: JP1.1 43.1,10 R11.1
SO1
  Top 0.25: IC2.25 37.45,27.63 38.18,26.91 39.4,26.91 IC1.9
SO2
  Top 0.25: IC1.8 40.05,30.56 37.78,30.56 37.78,28.13 IC2.26
SS1N
  Bottom 0.25: R18.2 25.39,23.02 R18.2 25.4,22.22 24.45,22.22 23.34,21.11 22.38,21.11 20.64,19.37 R22.P$4
SS1P
  Bottom 0.25: R19.2 23.97,22.7 23.02,21.75 R22.P$3
  Bottom 0.254: 20.65,21.73 arc-90 R22.P$3
SS2N
  Bottom 0.25: R33.P$3 22.23,30.96 R29.2
SS2P
  Bottom 0.25: R33.P$4 21.91,25.88 22.23,26.19 R30.2
V_SNS  (via drill 0.3)
  Top 0.25: 40.7,29.19 IC1.7
  Top 0.254: v41.59,30.56 40.7,29.66 40.7,29.19
  Bottom 0.25: R34.1 37.07,14.45 R35.2 37.07,12.3 40.4,12.3 40.4,18.57 43.1,21.27 43.1,23.81 44.85,23.81 | 44.77,30.56 v41.59,30.56
  Bottom 0.254: 44.85,23.81 44.85,30.48 arc90 44.77,30.56
VCC  (via drill 0.3)
  Top 0.25: IC2.53 26.9,17.13 v26.59,16.75 26.94,16.63 IC2.54 28.77,16.63 29.37,16.03 29.37,15.32 29.69,15 30.96,15 31.51,15.56 31.51,17.78 32.23,18.49 33.02,18.49 33.66,19.13 IC2.8 36.51,19.13 36.51,20.13 IC2.10
  Bottom 0.25: R34.2 31.51,14.45 31.51,16.99 30.16,16.99 29.92,16.75 v26.59,16.75 26.59,16.83
  Bottom 0.406: v12.22,5.71 15.48,5.71 26.59,16.83
  pour Top (no thermals): 8.89,35.72 1.27,35.72 1.27,2.94 12.62,2.94 12.62,8.1 4.52,8.1 4.52,12.54 8.89,12.54 8.89,16.99 5.08,16.99 5.08,21.43 8.89,21.43 8.89,25.88 5.08,25.88 5.08,30.32 8.89,30.32
VSENSE
  Top 0.25: IC2.3 32.07,16.63 32.07,10.64 | 32.07,10.64 30.48,10.64 R6.2 | 32.07,10.64 32.07,9.94 R7.1